# EAGLE design Solid-State Sidekick v1 (EAGLE 8.4.1)
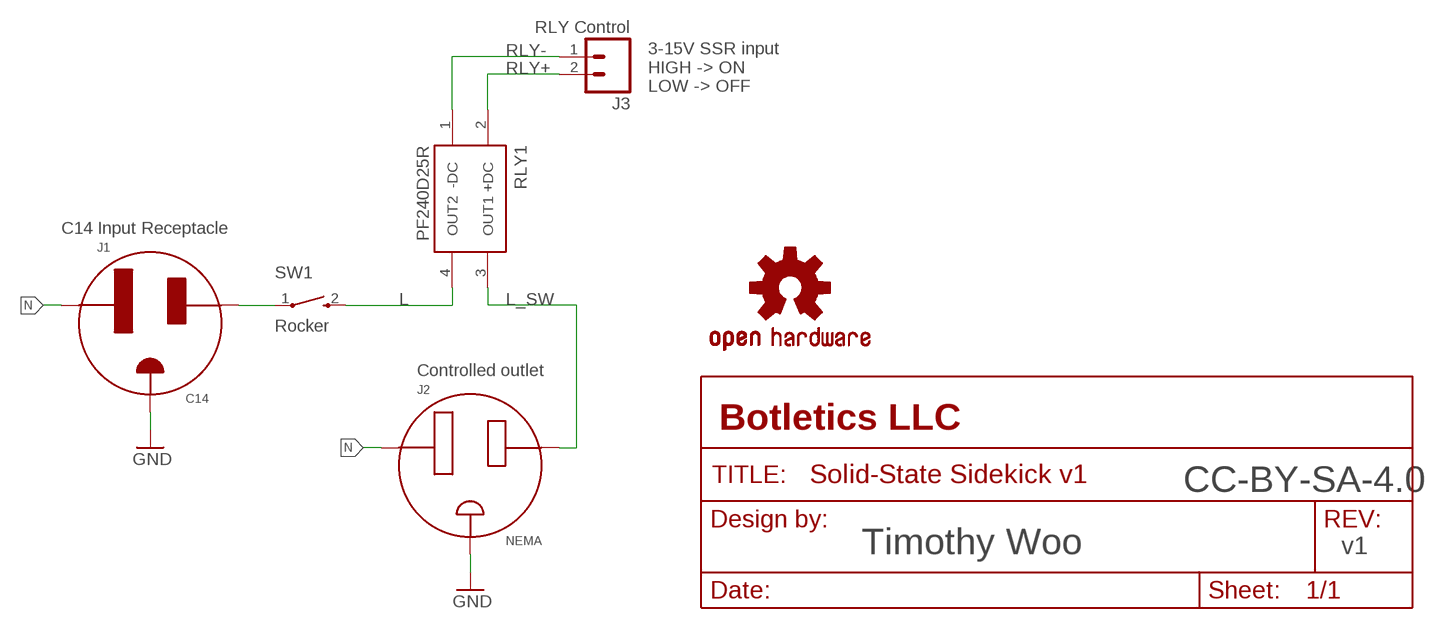
[diagram p0: schematic, sheet 1]

## Parts
J1  C14  AC_MALE_RECEPTACLEC14_RIGHTANGLE  [703W-00/53]
J2  NEMA  AC_FEMALE_RECEPTACLENEMA_5-15R  [3-213598-2]
J3  RLY Control  M023.5MM  [SCREWTERMINAL-3.5MM-2]
LOGO1  OSHW-LOGOL  [OSHW-LOGO-L]
RLY1  PF240D25R  RELAY_SSR_OPTO-ISOLATEDPF240  [RELAY_PF240]
SW1  Rocker  SWITCH_SPST_2-PINROCKER  [R1966ABLKBLKFR]

## Nets
GND: J1.E J2.GND(E)
L: RLY1.4(OUT2) SW1.2
L_SW: J2.L RLY1.3(OUT1)
L_WALL: J1.L SW1.1
N: J1.N J2.N
RLY+: J3.2 RLY1.2(+DC)
RLY-: J3.1 RLY1.1(-DC)

## Notes on the sheet
- 3-15V SSR input
  HIGH -> ON
  LOW -> OFF
- C14 Input Receptacle
- Controlled outlet
- CC-BY-SA-4.0
- Timothy Woo | v1

## Library data of the parts
J1 = TimWoo-Connectors:AC_MALE_RECEPTACLE
J2 = TimWoo-Connectors:AC_FEMALE_RECEPTACLE
J3 = TimWoo-Connectors:M02: Standard 2-pin 0.1" header. Use with - straight break away headers ( PRT-00116) - right angle break away headers (PRT-00553) - swiss pins (PRT-00743) - machine pins (PRT-00117) - female headers (PRT-00115) Molex polarized connector foot print use with: PRT-08233 with associated crimp pins and housings. 2.54_SCREWTERM for use with PRT-10571. 3.5mm Screw Terminal footprints for PRT-08084 5mm Screw Terminal footprints for use with PRT-08432; PROD_ID: CONN-08399
LOGO1 = SparkFun-Aesthetics:OSHW-LOGO: Open-Source Hardware (OSHW) Logo This logo indicates the piece of hardware it is found on incorporates a OSHW license and/or adheres to the definition of open source hardware found here: http://freedomdefined.org/OSHW
RLY1 = TimWoo-Electromechanical:RELAY_SSR_OPTO-ISOLATED
SW1 = TimWoo-Electromechanical:SWITCH_SPST_2-PIN

## Board
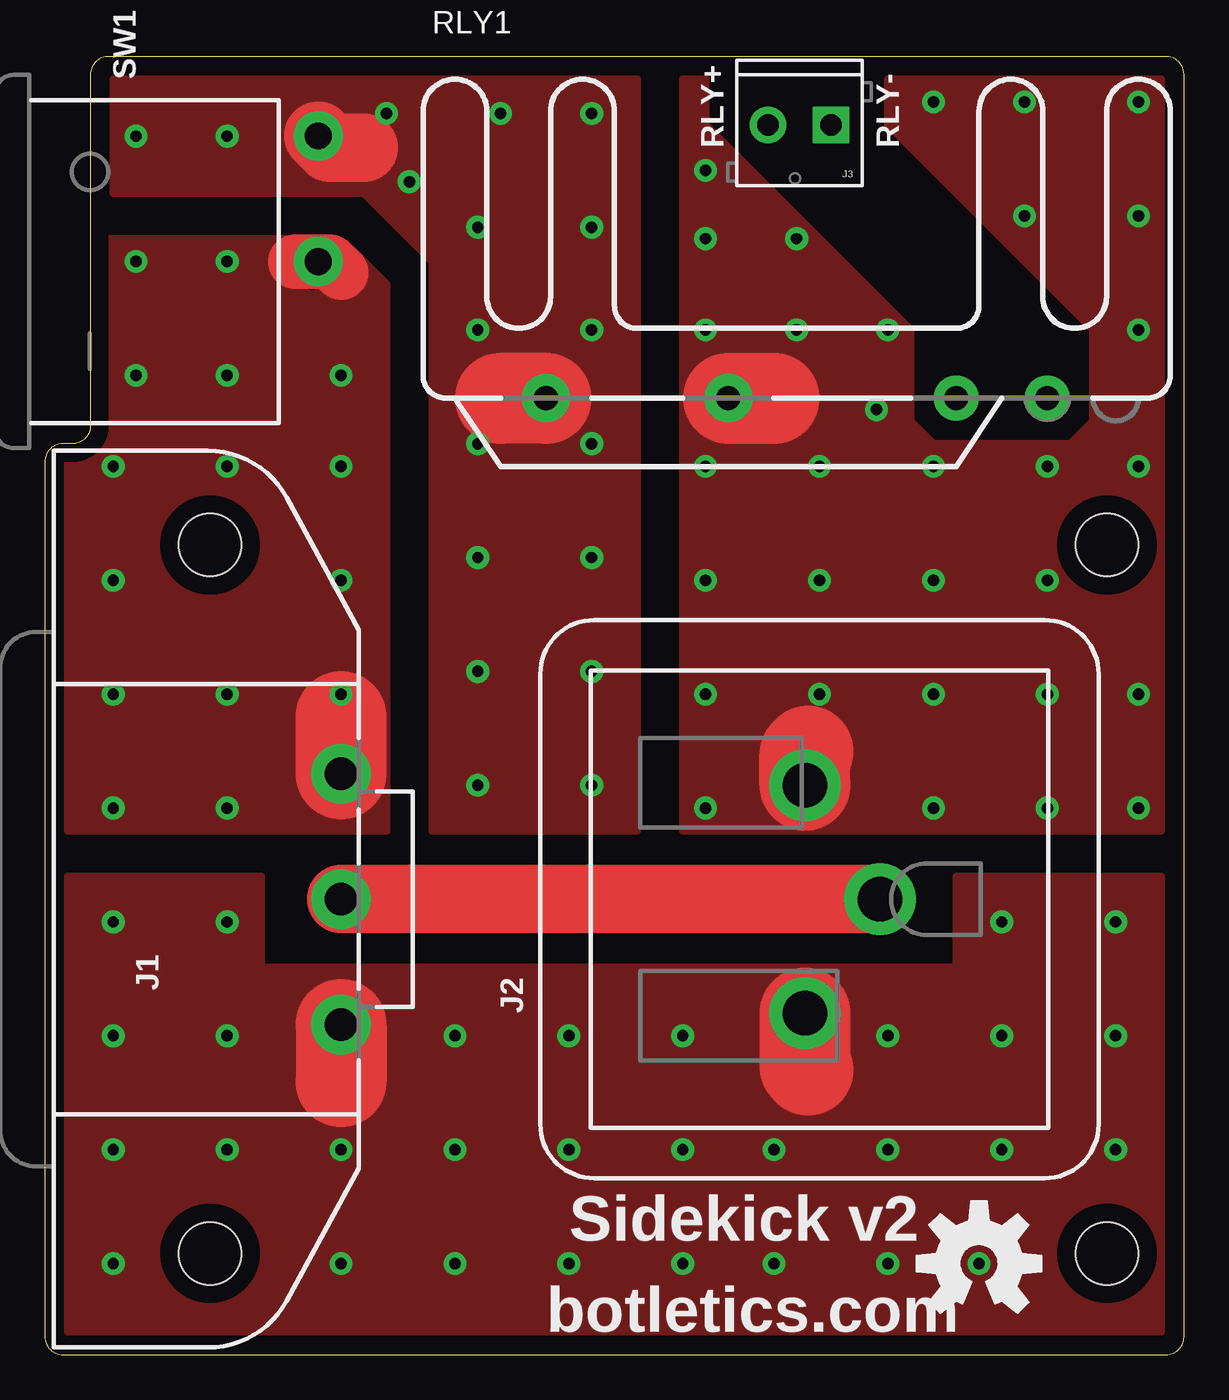
[diagram p1: board, top side]
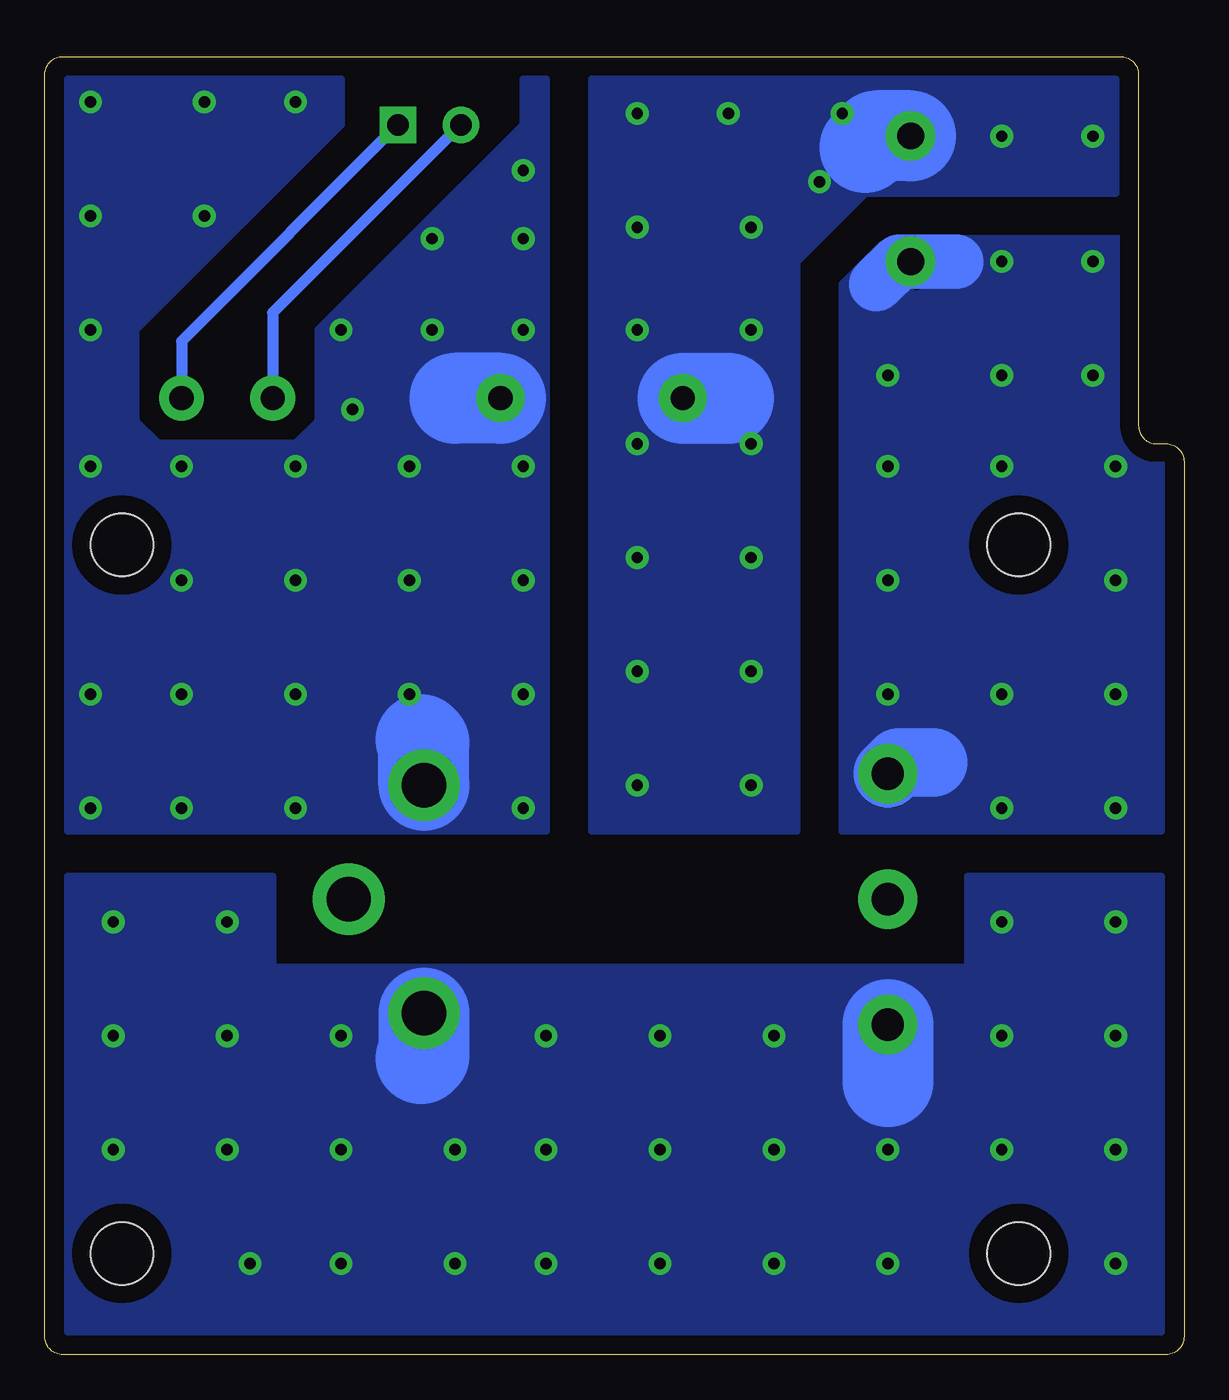
[diagram p2: board, bottom side, seen from below]

Size 63.5 x 72.39 mm. Coordinates in mm from the lower left corner, seen from the top.
Outline: 0,49.8 0,1 arc90 1,0 62.5,0 arc90 63.5,1 63.5,71.39 arc90 62.5,72.39 3.54,72.39 arc90 2.54,71.39 2.54,51.8 arc-90 1.54,50.8 1,50.8 arc90 0,49.8
Copper layers (1*16): Top 0.035mm / dielectric 1.5mm / Bottom 0.035mm
Design rules "default": minimum track width 6mil, minimum drill 0.35mm, track to track 6mil, track to pad 6mil, pad to pad 6mil, via to via 6mil, smd to smd 6mil, copper to edge 40mil, drill to drill 6mil, minimum pad ring 10mil, minimum via ring 8mil, stop-mask expansion 4mil, vias tented up to drill 0mil, thermal gap 10mil
Holes 3.5 mm at 59.21,45.15 59.21,5.65

### Footprints (pad centres in the part's own frame; a part is rotated, then mirrored left to right if it is on the bottom)
703W-00/53 = drill 1.8 pad 3.3: E 0,0; L 7,0; N -7,0 | hole 3.5: 19.75,7.3; -19.75,7.3
3-213598-2 = drill 2.47 pad 4: GND 0,-3.38; L 6.35,0.81; N -6.35,0.81
SCREWTERMINAL-3.5MM-2 = drill 1.2 pad 2.032 square: 1 0,0 | drill 1.2 pad 2.032: 2 3.5,0
RELAY_PF240 = drill 1.35 pad 2.5: 1 13.97,0; 2 8.89,0 | drill 1.35 pad 2.7: 3 -3.81,0; 4 -13.97,0
R1966ABLKBLKFR = drill 1.5 pad 2.75: 1 0,0; 2 7,0

### Placement (x,y rotation side)
J1  16.51,25.4 90 top
J2  43.18,25.4 90 top
J3  43.81,68.58 180 top
LOGO1  52.07,5.08 0 top
RLY1  41.91,53.34 0 top
SW1  15.24,60.96 90 top

### Tracks (layer width: path | path; a pad name or v marks a point on that pad's centre or on a via)
GND
  Top 3.81: J1.E J2.GND
L  (via drill 0.64 pad 1.27)
  Top 3.81: SW1.2 15.89,67.31 17.78,67.31
  Top 5.08: RLY1.4 25.4,53.34
  Bottom 5.08: SW1.2 17.13,67.96 17.78,67.31 | RLY1.4 25.4,53.34
  other vias: 5.08,67.94 10.16,67.94 25.4,69.22 20.32,65.41 24.13,62.87 24.13,44.45 24.13,38.1 24.13,31.75 30.48,38.1 30.48,31.75 30.48,44.45 19.05,69.22 30.48,69.22 30.48,62.87 30.48,57.15 30.48,50.8 24.13,50.8 24.13,57.15
  pour Top: 21.59,29.21 21.59,60.96 17.78,64.77 3.81,64.77 3.81,71.12 33.02,71.12 33.02,29.21
  pour Bottom: 3.81,71.12 3.81,64.77 17.78,64.77 21.59,60.96 21.59,29.21 33.02,29.21 33.02,71.12
L_SW  (via drill 0.64 pad 1.27)
  Top 5.08: RLY1.3 40.64,53.34 | J2.L 42.37,33.48 42.55,33.66
  Bottom 5.08: RLY1.3 40.64,53.34 | J2.L 42.37,34.12 42.55,34.29
  other vias: 36.83,66.04 41.91,62.23 41.91,57.15 49.53,69.85 54.61,69.85 60.96,69.85 60.96,57.15 54.61,63.5 60.96,63.5 36.83,57.15 36.83,49.53 43.18,49.53 36.83,43.18 43.18,43.18 36.83,36.83 43.18,36.83 49.53,36.83 55.88,36.83 60.96,36.83 60.96,30.48 55.88,30.48 49.53,30.48 49.53,43.18 55.88,43.18 49.53,49.53 36.83,30.48 55.88,49.53 60.96,49.53 46.99,57.15 36.83,62.23 46.35,52.7
  pour Bottom: 35.56,71.12 36.83,71.12 36.83,68.58 48.26,57.15 48.26,52.07 49.53,50.8 57.15,50.8 58.42,52.07 58.42,57.15 46.99,68.58 46.99,71.12 62.23,71.12 62.23,29.21 35.56,29.21
  pour Top: 35.56,71.12 36.83,71.12 36.83,68.58 48.26,57.15 48.26,52.07 49.53,50.8 57.15,50.8 58.42,52.07 58.42,57.15 46.99,68.58 46.99,71.12 62.23,71.12 62.23,29.21 35.56,29.21
L_WALL  (via drill 0.64 pad 1.27)
  Top 3.048: 13.97,60.96 SW1.1 15.88,60.96 16.51,60.33
  Top 5.08: J1.L 16.51,35.56
  Bottom 3.048: 12.7,60.96 SW1.1 15.88,60.96 17.14,59.69
  Bottom 3.81: J1.L 15.89,33.02 13.97,33.02
  other vias: 5.08,60.96 10.16,60.96 10.16,54.61 5.08,54.61 3.81,49.53 3.81,43.18 3.81,36.83 10.16,36.83 3.81,30.48 10.16,30.48 10.16,49.53 16.51,49.53 16.51,43.18 16.51,36.83 16.51,54.61
  pour Top: 19.05,29.21 1.27,29.21 1.27,62.23 16.51,62.23 19.05,59.69
  pour Bottom: 1.27,62.23 16.51,62.23 19.05,59.69 19.05,29.21 1.27,29.21
N  (via drill 0.64 pad 1.27)
  Top 5.08: J1.N 16.51,15.24 | J2.N 42.37,16.05 42.55,15.88
  Bottom 5.08: J1.N 16.51,15.24 | J2.N 42.37,16.68 42.55,16.51
  other vias: 3.81,24.13 10.16,24.13 3.81,17.78 10.16,17.78 3.81,11.43 3.81,5.08 10.16,11.43 16.51,11.43 16.51,5.08 22.86,5.08 22.86,11.43 22.86,17.78 29.21,17.78 29.21,11.43 35.56,11.43 40.64,11.43 40.64,5.08 46.99,5.08 46.99,11.43 46.99,17.78 53.34,17.78 53.34,11.43 52.07,5.08 59.69,11.43 59.69,17.78 29.21,5.08 35.56,5.08 53.34,24.13 59.69,24.13 35.56,17.78
  pour Top: 1.27,26.67 12.06,26.67 12.06,21.59 50.8,21.59 50.8,26.67 62.23,26.67 62.23,1.27 1.27,1.27
  pour Bottom: 1.27,26.67 12.06,26.67 12.06,21.59 50.8,21.59 50.8,26.67 62.23,26.67 62.23,1.27 1.27,1.27
RLY+
  Bottom 0.61: J3.2 50.8,58.09 RLY1.2
RLY-
  Bottom 0.61: J3.1 55.88,56.52 RLY1.1

### Text on the board
tPlace: RLY+ | RLY- | Sidekick v2 | botletics.com
tDocu: Designed by Timothy Woo / Released under CC-BY-SA-4.0 license